# Altium schematic sheet AVR Board 4.0 Processors .SchDoc
size B
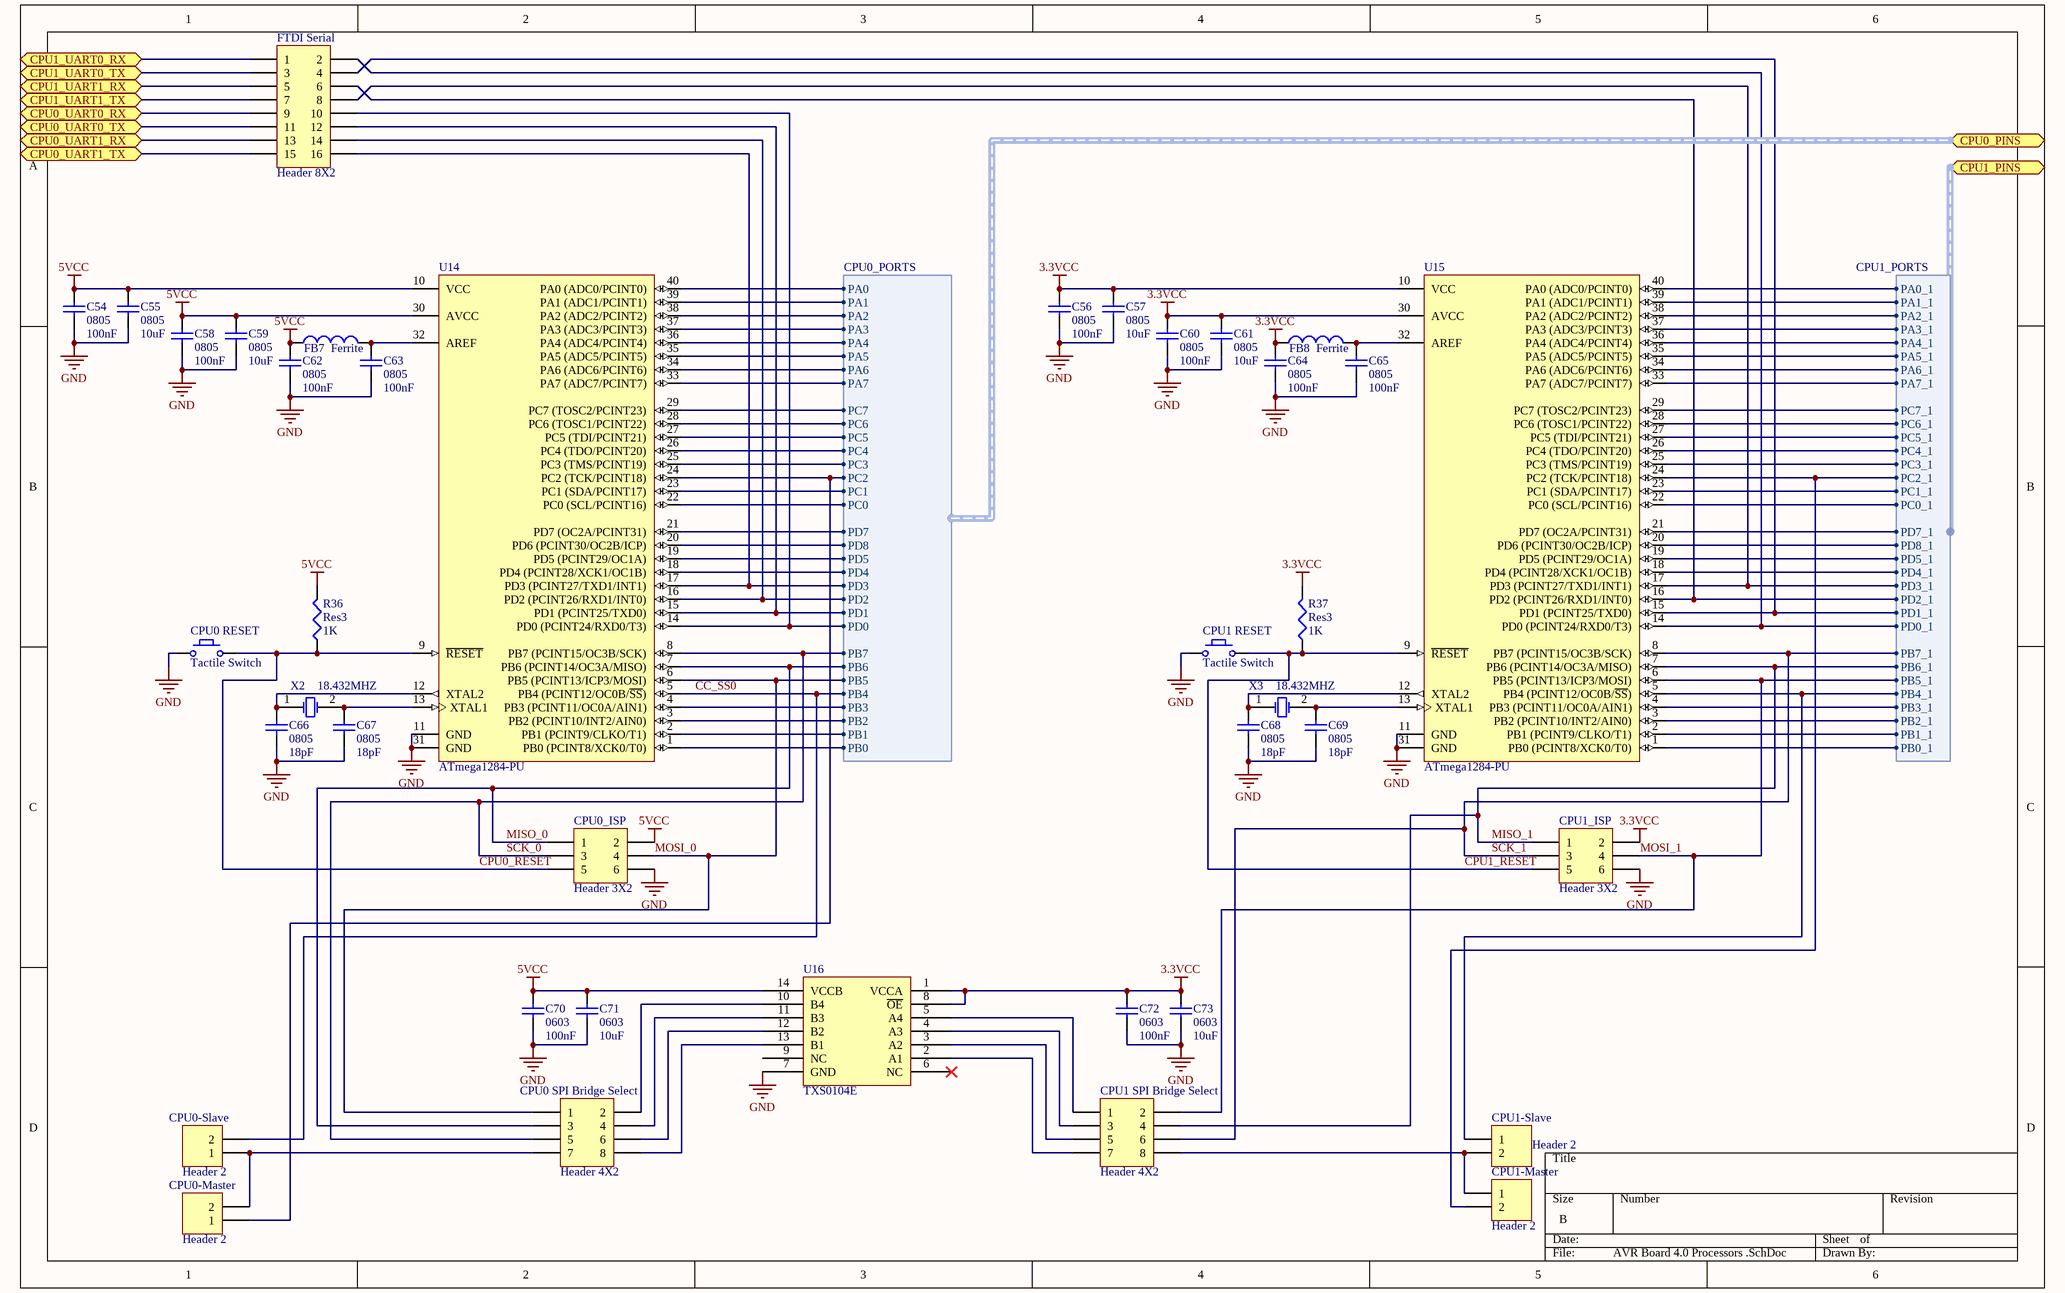
[diagram p0: AVR Board 4.0 Processors .SchDoc]

## Parts
C54  0805  value 100nF  [SM 0805 - gap trimmed]
C55  0805  value 10uF  [SM 0805 - gap trimmed]
C56  0805  value 100nF  [SM 0805 - gap trimmed]
C57  0805  value 10uF  [SM 0805 - gap trimmed]
C58  0805  value 100nF  [SM 0805 - gap trimmed]
C59  0805  value 10uF  [SM 0805 - gap trimmed]
C60  0805  value 100nF  [SM 0805 - gap trimmed]
C61  0805  value 10uF  [SM 0805 - gap trimmed]
C62  0805  value 100nF  [SM 0805 - gap trimmed]
C63  0805  value 100nF  [SM 0805 - gap trimmed]
C64  0805  value 100nF  [SM 0805 - gap trimmed]
C65  0805  value 100nF  [SM 0805 - gap trimmed]
C66  0805  value 18pF  [SM 0805 - gap trimmed]
C67  0805  value 18pF  [SM 0805 - gap trimmed]
C68  0805  value 18pF  [SM 0805 - gap trimmed]
C69  0805  value 18pF  [SM 0805 - gap trimmed]
C70  0603  value 100nF  [1608[0603]]
C71  0603  value 10uF  [1608[0603]]
C72  0603  value 100nF  [1608[0603]]
C73  0603  value 10uF  [1608[0603]]
CPU0-Master  Header 2  [HDR1X2]
CPU0-Slave  Header 2  [HDR1X2]
CPU0_ISP  Header 3X2  [HDR2X3]
CPU0_RESET  Tactile Switch  [Mountain Switch TS6324T1607]
CPU0_SPI_Bridge_Select  Header 4X2  [HDR2X4]
CPU1-Master  Header 2  [HDR1X2]
CPU1-Slave  Header 2  [HDR1X2]
CPU1_ISP  Header 3X2  [HDR2X3]
CPU1_RESET  Tactile Switch  [Mountain Switch TS6324T1607]
CPU1_SPI_Bridge_Select  Header 4X2  [HDR2X4]
FB7  value Ferrite  [SM 0805 - gap trimmed]  (hidden comment: Inductor)
FB8  value Ferrite  [SM 0805 - gap trimmed]  (hidden comment: Inductor)
FTDI_Serial  Header 8X2  [HDR2X8]
R36  Res3  value 1K  [J1-0603]
R37  Res3  value 1K  [J1-0603]
U14  ATmega1284-PU  [40P6]
U15  ATmega1284-PU  [40P6]
U16  TXS0104E  [SOIC127P600X175-14N]
X2  18.432MHZ  [radial 4.88]
X3  18.432MHZ  [radial 4.88]

## Ports
CPU0_PINS (harness CPU0_PORTS), CPU0_UART0_RX, CPU0_UART0_TX, CPU0_UART1_RX, CPU0_UART1_TX, CPU1_PINS (harness CPU1_PORTS), CPU1_UART0_RX, CPU1_UART0_TX, CPU1_UART1_RX, CPU1_UART1_TX

## Harnesses
CPU0_PORTS: PA0, PA1, PA2, PA3, PA4, PA5, PA6, PA7, PC0, PC1, PC2, PC3, PC4, PC5, PC6, PC7, PD7, PD8, PD5, PD4, PD3, PD2, PD1, PD0, PB7, PB6, PB5, PB4, PB3, PB2, PB1, PB0
CPU1_PORTS: PA0_1, PA1_1, PA2_1, PA3_1, PA4_1, PA5_1, PA6_1, PA7_1, PC0_1, PC1_1, PC2_1, PC3_1, PC4_1, PC5_1, PC6_1, PC7_1, PD7_1, PD8_1, PD5_1, PD4_1, PD3_1, PD2_1, PD1_1, PD0_1, PB7_1, PB6_1, PB5_1, PB4_1, PB3_1, PB2_1, PB1_1, PB0_1

## Nets
3.3VCC: C56.2 C57.2 C60.2 C61.2 C64.2 C72.2 C73.2 CPU1_ISP.2 FB8.1 R37.2 U15.10(VCC) U15.30(AVCC) U16.1(VCCA) U16.8(~{OE})
5VCC: C54.2 C55.2 C58.2 C59.2 C62.2 C70.2 C71.2 CPU0_ISP.2 FB7.1 R36.2 U14.10(VCC) U14.30(AVCC) U16.14(VCCB)
GND: C54.1 C55.1 C56.1 C57.1 C58.1 C59.1 C60.1 C61.1 C62.1 C63.1 C64.1 C65.1 C66.1 C67.1 C68.1 C69.1 C70.1 C71.1 C72.1 C73.1 CPU0_ISP.6 CPU0_RESET.1 CPU1_ISP.6 CPU1_RESET.1 U14.11(GND) U14.31(GND) U15.11(GND) U15.31(GND) U16.7(GND)
CC_SS0: CPU0-Slave.2 U14.5(PB4_(PCINT12/OC0B/~{SS})) ; port CPU0_PINS.PB4
CPU0_RESET: CPU0_ISP.5 CPU0_RESET.2 R36.1 U14.9(~{RESET})
CPU0_UART0_RX: FTDI_Serial.9 ; port CPU0_UART0_RX
CPU0_UART0_TX: FTDI_Serial.11 ; port CPU0_UART0_TX
CPU0_UART1_RX: FTDI_Serial.13 ; port CPU0_UART1_RX
CPU0_UART1_TX: FTDI_Serial.15 ; port CPU0_UART1_TX
CPU1_RESET: CPU1_ISP.5 CPU1_RESET.2 R37.1 U15.9(~{RESET})
CPU1_UART0_RX: FTDI_Serial.1 ; port CPU1_UART0_RX
CPU1_UART0_TX: FTDI_Serial.3 ; port CPU1_UART0_TX
CPU1_UART1_RX: FTDI_Serial.5 ; port CPU1_UART1_RX
CPU1_UART1_TX: FTDI_Serial.7 ; port CPU1_UART1_TX
MISO_0: CPU0_ISP.1 CPU0_SPI_Bridge_Select.3 U14.7(PB6_(PCINT14/OC3A/MISO)) ; port CPU0_PINS.PB6
MISO_1: CPU1_ISP.1 CPU1_SPI_Bridge_Select.4 U15.7(PB6_(PCINT14/OC3A/MISO)) ; port CPU1_PINS.PB6_1
MOSI_0: CPU0_ISP.4 CPU0_SPI_Bridge_Select.1 U14.6(PB5_(PCINT13/ICP3/MOSI)) ; port CPU0_PINS.PB5
MOSI_1: CPU1_ISP.4 CPU1_SPI_Bridge_Select.2 U15.6(PB5_(PCINT13/ICP3/MOSI)) ; port CPU1_PINS.PB5_1
SCK_0: CPU0_ISP.3 CPU0_SPI_Bridge_Select.5 U14.8(PB7_(PCINT15/OC3B/SCK)) ; port CPU0_PINS.PB7
SCK_1: CPU1_ISP.3 CPU1_SPI_Bridge_Select.6 U15.8(PB7_(PCINT15/OC3B/SCK)) ; port CPU1_PINS.PB7_1
NetC63_2: C63.2 FB7.2 U14.32(AREF)
NetC65_2: C65.2 FB8.2 U15.32(AREF)
NetC66_2: C66.2 U14.12(XTAL2) X2.1(OSC1)
NetC67_2: C67.2 U14.13(XTAL1) X2.2(OSC2)
NetC68_2: C68.2 U15.12(XTAL2) X3.1(OSC1)
NetC69_2: C69.2 U15.13(XTAL1) X3.2(OSC2)
NetCPU0-Master_1: CPU0-Master.1 U14.24(PC2_(TCK/PCINT18)) ; port CPU0_PINS.PC2
NetCPU0-Master_2: CPU0-Master.2 CPU0-Slave.1 CPU0_SPI_Bridge_Select.7
NetCPU0_SPI_Bridge_Select_2: CPU0_SPI_Bridge_Select.2 U16.10(B4)
NetCPU0_SPI_Bridge_Select_4: CPU0_SPI_Bridge_Select.4 U16.11(B3)
NetCPU0_SPI_Bridge_Select_6: CPU0_SPI_Bridge_Select.6 U16.12(B2)
NetCPU0_SPI_Bridge_Select_8: CPU0_SPI_Bridge_Select.8 U16.13(B1)
NetCPU1-Master_1: CPU1-Master.1 CPU1-Slave.2 CPU1_SPI_Bridge_Select.8
NetCPU1-Master_2: CPU1-Master.2 U15.24(PC2_(TCK/PCINT18)) ; port CPU1_PINS.PC2_1
NetCPU1-Slave_1: CPU1-Slave.1 U15.5(PB4_(PCINT12/OC0B/~{SS})) ; port CPU1_PINS.PB4_1
NetCPU1_SPI_Bridge_Select_1: CPU1_SPI_Bridge_Select.1 U16.5(A4)
NetCPU1_SPI_Bridge_Select_3: CPU1_SPI_Bridge_Select.3 U16.4(A3)
NetCPU1_SPI_Bridge_Select_5: CPU1_SPI_Bridge_Select.5 U16.3(A2)
NetCPU1_SPI_Bridge_Select_7: CPU1_SPI_Bridge_Select.7 U16.2(A1)
NetFTDI_Serial_2: FTDI_Serial.2 U15.14(PD0_(PCINT24/RXD0/T3)) ; port CPU1_PINS.PD0_1
NetFTDI_Serial_4: FTDI_Serial.4 U15.15(PD1_(PCINT25/TXD0)) ; port CPU1_PINS.PD1_1
NetFTDI_Serial_6: FTDI_Serial.6 U15.16(PD2_(PCINT26/RXD1/INT0)) ; port CPU1_PINS.PD2_1
NetFTDI_Serial_8: FTDI_Serial.8 U15.17(PD3_(PCINT27/TXD1/INT1)) ; port CPU1_PINS.PD3_1
NetFTDI_Serial_10: FTDI_Serial.10 U14.14(PD0_(PCINT24/RXD0/T3)) ; port CPU0_PINS.PD0
NetFTDI_Serial_12: FTDI_Serial.12 U14.15(PD1_(PCINT25/TXD0)) ; port CPU0_PINS.PD1
NetFTDI_Serial_14: FTDI_Serial.14 U14.16(PD2_(PCINT26/RXD1/INT0)) ; port CPU0_PINS.PD2
NetFTDI_Serial_16: FTDI_Serial.16 U14.17(PD3_(PCINT27/TXD1/INT1)) ; port CPU0_PINS.PD3
NetU14_1: U14.1(PB0_(PCINT8/XCK0/T0)) ; port CPU0_PINS.PB0
NetU14_2: U14.2(PB1_(PCINT9/CLKO/T1)) ; port CPU0_PINS.PB1
NetU14_3: U14.3(PB2_(PCINT10/INT2/AIN0)) ; port CPU0_PINS.PB2
NetU14_4: U14.4(PB3_(PCINT11/OC0A/AIN1)) ; port CPU0_PINS.PB3
NetU14_18: U14.18(PD4_(PCINT28/XCK1/OC1B)) ; port CPU0_PINS.PD4
NetU14_19: U14.19(PD5_(PCINT29/OC1A)) ; port CPU0_PINS.PD5
NetU14_20: U14.20(PD6_(PCINT30/OC2B/ICP)) ; port CPU0_PINS.PD8
NetU14_21: U14.21(PD7_(OC2A/PCINT31)) ; port CPU0_PINS.PD7
NetU14_22: U14.22(PC0_(SCL/PCINT16)) ; port CPU0_PINS.PC0
NetU14_23: U14.23(PC1_(SDA/PCINT17)) ; port CPU0_PINS.PC1
NetU14_25: U14.25(PC3_(TMS/PCINT19)) ; port CPU0_PINS.PC3
NetU14_26: U14.26(PC4_(TDO/PCINT20)) ; port CPU0_PINS.PC4
NetU14_27: U14.27(PC5_(TDI/PCINT21)) ; port CPU0_PINS.PC5
NetU14_28: U14.28(PC6_(TOSC1/PCINT22)) ; port CPU0_PINS.PC6
NetU14_29: U14.29(PC7_(TOSC2/PCINT23)) ; port CPU0_PINS.PC7
NetU14_33: U14.33(PA7_(ADC7/PCINT7)) ; port CPU0_PINS.PA7
NetU14_34: U14.34(PA6_(ADC6/PCINT6)) ; port CPU0_PINS.PA6
NetU14_35: U14.35(PA5_(ADC5/PCINT5)) ; port CPU0_PINS.PA5
NetU14_36: U14.36(PA4_(ADC4/PCINT4)) ; port CPU0_PINS.PA4
NetU14_37: U14.37(PA3_(ADC3/PCINT3)) ; port CPU0_PINS.PA3
NetU14_38: U14.38(PA2_(ADC2/PCINT2)) ; port CPU0_PINS.PA2
NetU14_39: U14.39(PA1_(ADC1/PCINT1)) ; port CPU0_PINS.PA1
NetU14_40: U14.40(PA0_(ADC0/PCINT0)) ; port CPU0_PINS.PA0
NetU15_1: U15.1(PB0_(PCINT8/XCK0/T0)) ; port CPU1_PINS.PB0_1
NetU15_2: U15.2(PB1_(PCINT9/CLKO/T1)) ; port CPU1_PINS.PB1_1
NetU15_3: U15.3(PB2_(PCINT10/INT2/AIN0)) ; port CPU1_PINS.PB2_1
NetU15_4: U15.4(PB3_(PCINT11/OC0A/AIN1)) ; port CPU1_PINS.PB3_1
NetU15_18: U15.18(PD4_(PCINT28/XCK1/OC1B)) ; port CPU1_PINS.PD4_1
NetU15_19: U15.19(PD5_(PCINT29/OC1A)) ; port CPU1_PINS.PD5_1
NetU15_20: U15.20(PD6_(PCINT30/OC2B/ICP)) ; port CPU1_PINS.PD8_1
NetU15_21: U15.21(PD7_(OC2A/PCINT31)) ; port CPU1_PINS.PD7_1
NetU15_22: U15.22(PC0_(SCL/PCINT16)) ; port CPU1_PINS.PC0_1
NetU15_23: U15.23(PC1_(SDA/PCINT17)) ; port CPU1_PINS.PC1_1
NetU15_25: U15.25(PC3_(TMS/PCINT19)) ; port CPU1_PINS.PC3_1
NetU15_26: U15.26(PC4_(TDO/PCINT20)) ; port CPU1_PINS.PC4_1
NetU15_27: U15.27(PC5_(TDI/PCINT21)) ; port CPU1_PINS.PC5_1
NetU15_28: U15.28(PC6_(TOSC1/PCINT22)) ; port CPU1_PINS.PC6_1
NetU15_29: U15.29(PC7_(TOSC2/PCINT23)) ; port CPU1_PINS.PC7_1
NetU15_33: U15.33(PA7_(ADC7/PCINT7)) ; port CPU1_PINS.PA7_1
NetU15_34: U15.34(PA6_(ADC6/PCINT6)) ; port CPU1_PINS.PA6_1
NetU15_35: U15.35(PA5_(ADC5/PCINT5)) ; port CPU1_PINS.PA5_1
NetU15_36: U15.36(PA4_(ADC4/PCINT4)) ; port CPU1_PINS.PA4_1
NetU15_37: U15.37(PA3_(ADC3/PCINT3)) ; port CPU1_PINS.PA3_1
NetU15_38: U15.38(PA2_(ADC2/PCINT2)) ; port CPU1_PINS.PA2_1
NetU15_39: U15.39(PA1_(ADC1/PCINT1)) ; port CPU1_PINS.PA1_1
NetU15_40: U15.40(PA0_(ADC0/PCINT0)) ; port CPU1_PINS.PA0_1

Not connected (* = marked no-connect by the designer): U16 6(NC)* 9(NC)

## Library data of the parts
C54-C73 = Cap Semi: Capacitor (Semiconductor SIM Model); Published: 8-Jun-2000; LatestRevisionDate: 29-May-2009; LatestRevisionNote: IPC-7351 Footprint Added.; PackageReference: C1206; Publisher: Altium Limited; PackageDescription: Chip Capacitor
CPU0-Master CPU0-Slave CPU1-Master CPU1-Slave = Header 2: Header, 2-Pin; LatestRevisionDate: 17-Jul-2002; LatestRevisionNote: Re-released for DXP Platform.; Publisher: Altium Limited
CPU0_ISP CPU1_ISP = Header 3X2: Header, 3-Pin, Dual row; LatestRevisionDate: 17-Jul-2002; LatestRevisionNote: Re-released for DXP Platform.; Publisher: Altium Limited
CPU0_SPI_Bridge_Select CPU1_SPI_Bridge_Select = Header 4X2: Header, 4-Pin, Dual row; LatestRevisionDate: 17-Jul-2002; LatestRevisionNote: Re-released for DXP Platform.; Publisher: Altium Limited
FB7 FB8 = Inductor: Code_IEC: 1005; Published: 8-Jun-2000; LatestRevisionDate: 29-May-2009; LatestRevisionNote: IPC-7351 Footprint Added.; PackageReference: 0402-A; Publisher: Altium Limited; PackageDescription: Chip Inductor; Code_JEITA: 0402
FTDI_Serial = Header 8X2: Header, 8-Pin, Dual row; LatestRevisionDate: 17-Jul-2002; LatestRevisionNote: Re-released for DXP Platform.; Publisher: Altium Limited
R36 R37 = Res3: Resistor; Published: 8-Jun-2000; LatestRevisionDate: 29-May-2009; LatestRevisionNote: IPC-7351 Footprint Added.; PackageReference: J1-0603; Publisher: Altium Limited; PackageDescription: Chip Resistor
U14 U15 = ATmega1284-PU: 8-bit AVR Microcontroller, 128KB Flash, 4KB EEPROM, 16KB SRAM, 40-pin PDIP, Industrial Grade (-40°C to 85°C); DatasheetVersion: revC, Jun-2011; PackageVersion: revB, Sep-2001; PackageReference: 40P6; PackageDescription: 40-lead (0.600"/15.24mm Wide) Plastic Dual Inline Package (PDIP); Code_JEDEC: MS-011-AC; ComponentLink1Description: Manufacturer URL; ComponentLink1URL: http://www.atmel.com/; ComponentLink2Description: ATmega164A/164PA/324A/324PA/644A/644PA/1284/1284P Datasheet; ComponentLink2URL: http://www.atmel.com/dyn/resources/prod_documents/doc8272.pdf; ComponentLink3Description: ATmega164A/164PA/324A/324PA/644A/644PA/1284/1284P Summary; ComponentLink3URL: http://www.atmel.com/dyn/resources/prod_documents/8272S.pdf
X2 X3 = XTAL: Crystal Oscillator; Published: 8-Jun-2000; LatestRevisionDate: 17-Jul-2002; LatestRevisionNote: Re-released for DXP Platform.; PackageReference: R38; Publisher: Altium Limited; PackageDescription: Crystal, Thru-Hole; 2 Leads; Body 3.1 x 8.2 mm (Dia.xH)